# EAGLE design RaspberryPiSigfoxBoard (EAGLE 8.1.1)
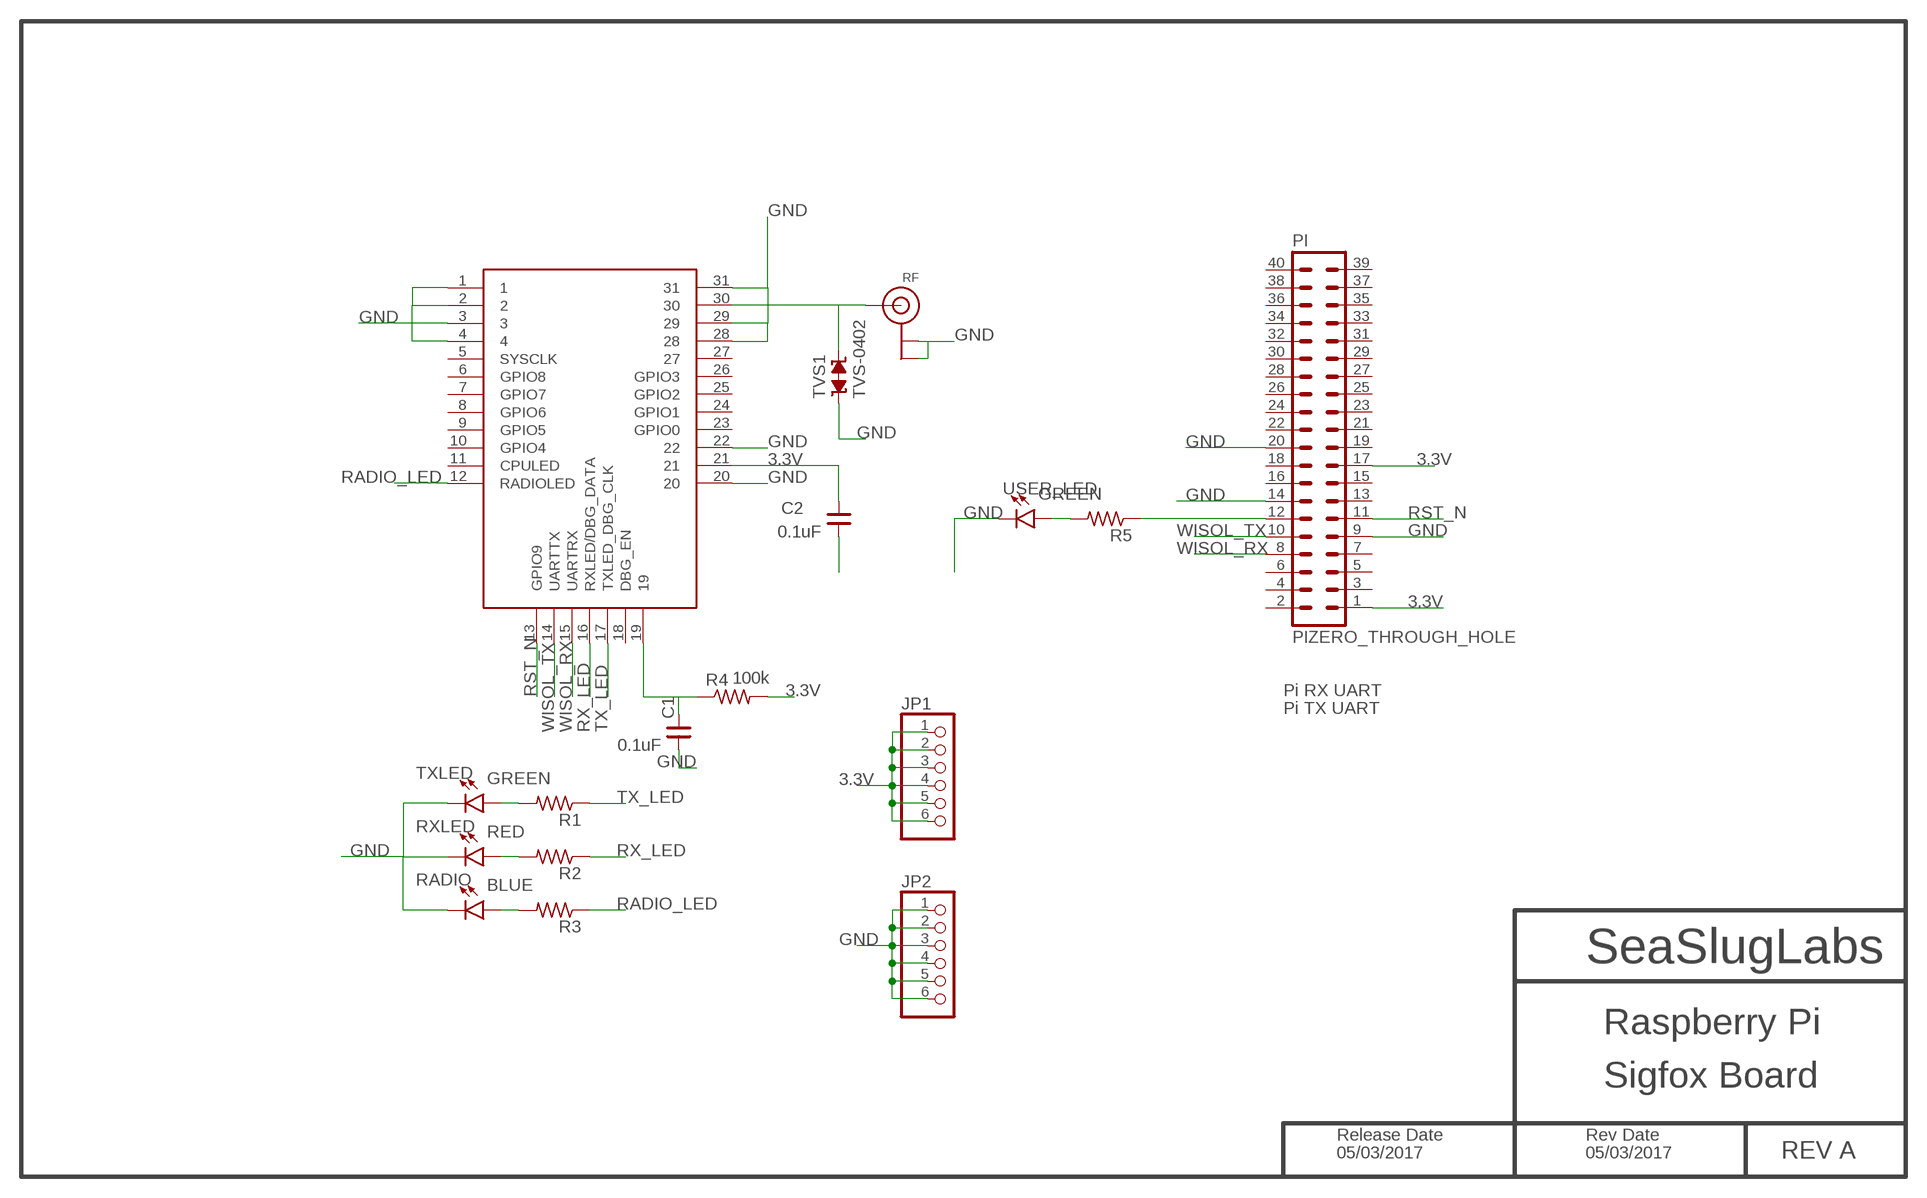
[diagram p0: schematic, sheet 1]

## Parts
C1  0.1uF  CNP-0402  [0402]
C2  0.1uF  CNP-0402  [0402]
JP1  PINHD-1X6B  [1X06-BIG]
JP2  PINHD-1X6B  [1X06-BIG]
PI  PIZERO_THROUGH_HOLE  [PIZERO_THOUGH_HOLE]
R1  R-US_R0402  [R0402]
R2  R-US_R0402  [R0402]
R3  R-US_R0402  [R0402]
R4  100k  R-US_R0402  [R0402]
R5  R-US_R0402  [R0402]
RADIO  BLUE  LED-BLUE0603  [LED-0603]
RF  ANTENNA_U.FL  [U.FL]
RXLED  RED  LED-RED0603  [LED-0603]
TVS1  TVS-0402  [TVS0402]
TXLED  GREEN  LED-GREEN0603  [LED-0603]
USER_LED  GREEN  LED-GREEN0603  [LED-0603]
WSSFM10R2  WSSFM10R2/R4WSSFM10R2R4  [WISOL]

## Nets
3.3V: C2.2 JP1.1 JP1.2 JP1.3 JP1.4 JP1.5 JP1.6 PI.1 PI.17 R4.2 WSSFM10R2.21
GND: C1.1 C2.1 JP2.1 JP2.2 JP2.3 JP2.4 JP2.5 JP2.6 PI.9 PI.14 PI.20 RADIO.C RF.1(GND) RF.2(GND) RXLED.C TVS1.1 TXLED.C USER_LED.C WSSFM10R2.1 WSSFM10R2.2 WSSFM10R2.3 WSSFM10R2.4 WSSFM10R2.20 WSSFM10R2.22 WSSFM10R2.28 WSSFM10R2.29 WSSFM10R2.31
N$1: C1.2 R4.1 WSSFM10R2.19
N$2: R1.2 TXLED.A
N$3: R2.2 RXLED.A
N$4: R3.2 RADIO.A
N$5: RF.3(SIGNAL) TVS1.2 WSSFM10R2.30
N$6: PI.12 R5.1
N$7: R5.2 USER_LED.A
RADIO_LED: R3.1 WSSFM10R2.12(RADIOLED)
RST_N: PI.11 WSSFM10R2.13(GPIO9)
RX_LED: R2.1 WSSFM10R2.16(RXLED/DBG_DATA)
TX_LED: R1.1 WSSFM10R2.17(TXLED_DBG_CLK)
WISOL_RX: PI.8 WSSFM10R2.15(UARTRX)
WISOL_TX: PI.10 WSSFM10R2.14(UARTTX)
Unconnected: PI.2 PI.3 PI.4 PI.5 PI.6 PI.7 PI.13 PI.15 PI.16 PI.18 PI.19 PI.21 PI.22 PI.23 PI.24 PI.25 PI.26 PI.27 PI.28 PI.29 PI.30 PI.31 PI.32 PI.33 PI.34 PI.35 PI.36 PI.37 PI.38 PI.39 PI.40 WSSFM10R2.5(SYSCLK) WSSFM10R2.6(GPIO8) WSSFM10R2.7(GPIO7) WSSFM10R2.8(GPIO6) WSSFM10R2.9(GPIO5) WSSFM10R2.10(GPIO4) WSSFM10R2.11(CPULED) WSSFM10R2.18(DBG_EN) WSSFM10R2.23(GPIO0) WSSFM10R2.24(GPIO1) WSSFM10R2.25(GPIO2) WSSFM10R2.26(GPIO3) WSSFM10R2.27

## Notes on the sheet
- Pi RX UART
- Pi TX UART
- SeaSlugLabs
- Raspberry Pi
- Sigfox Board
- Release Date | Rev Date
- 05/03/2017 | 05/03/2017 | REV A

## Library data of the parts
C1 C2 = IoTthings:CNP-: NON-POLARIZED CAP
JP1 JP2 = adafruit:PINHD-1X6: PIN HEADER
PI = pizero:PIZERO_THROUGH_HOLE
R1-R5 = IoTthings:R-US_: RESISTOR, American symbol
RADIO = IoTthings:LED-BLUE: Blue SMD LED Used in manufacturing of various products at SparkFun Packages: 0603 - SMD 0603 package [Product Link] <http://www.digikey.com/product-detail/en/SMLE12BC7TT86/511-1589-2-ND/1641808> 1206 - SMD1206 package [Product Link] <http://www.digikey.com/product-detail/en/lite-on-inc/LTST-C150TBKT/160-1643-1-ND/573584> SparkFun Products: ESP8266 Thing-Dev Board <https://www.sparkfun.com/products/13711> RedBoard <https://www.sparkfun.com/products/12757>; PROD_ID: DIO-08575
RF = IoTthings:ANTENNA_U.FL: U.FL Antenna Connector
RXLED = IoTthings:LED-RED: Red SMD LED Used in manufacturing of most products at SparkFun Packages: 0603 - SMD 0603 package [Product Link] <http://docs.avagotech.com/docs/AV02-0551EN> 0603 SMART - SMD 0603 SMART package ( more efficient and expensive)[Product Link] <http://www.osram-os.com/Graphics/XPic2/00077099_0.pdf> 1206 - SMD1206 package [Product Link] <https://www.sparkfun.com/datasheets/DevTools/LilyPad/Q150OVS4.pdff> SparkFun Products: Pro Mini 328 -5V <https://www.sparkfun.com/products/821> RedBoard <https://www.sparkfun.com/products/12757> IOIO-OTG <https://www.sparkfun.com/products/13613>; PROD_ID: DIO-00819
TVS1 = supressor:TVS-: TVS BI-DIRECTIONAL
TXLED USER_LED = IoTthings:LED-GREEN: Green SMD LED Used in manufacturing of various products at SparkFun Packages: 0603 - SMD 0603 package [Product Link] <http://www.futureelectronics.com/en/technologies/semiconductors/optoelectronics/leds/Pages/9894312-LTST-C190GKT.aspx?CrossPart=HSMG-C190&IM=0> LilyPad 1206 - SMD1206 LilyPad package [Product Link] <http://www.futureelectronics.com/en/Technologies/Product.aspx?ProductID=IN150NGHARVATEKCORPORATION2049943&IM=0> 1206 - SMD1206 package [Product Link] <http://www.futureelectronics.com/en/technologies/semiconductors/optoelectronics/leds/Pages/8315665-LTST-C150KGKT.aspx?IM=0> 1206 Bottom Mount -SMD 1206 Bottom Mount [Product Link] <http://www.digikey.com/product-detail/en/lite-on-inc/LTST-C230KGKT/160-1456-1-ND/386854> SparkFun Products: Pro Mini 328 -5V <https://www.sparkfun.com/products/821> RedBoard <https://www.sparkfun.com/products/12757> MP3 Trigger <https://www.sparkfun.com/products/13720> Makey Makey <https://www.sparkfun.com/products/11076>; PROD_ID: DIO-00821
WSSFM10R2 = SigfoxMod-RCZ1:WSSFM10R2/R4

## Board
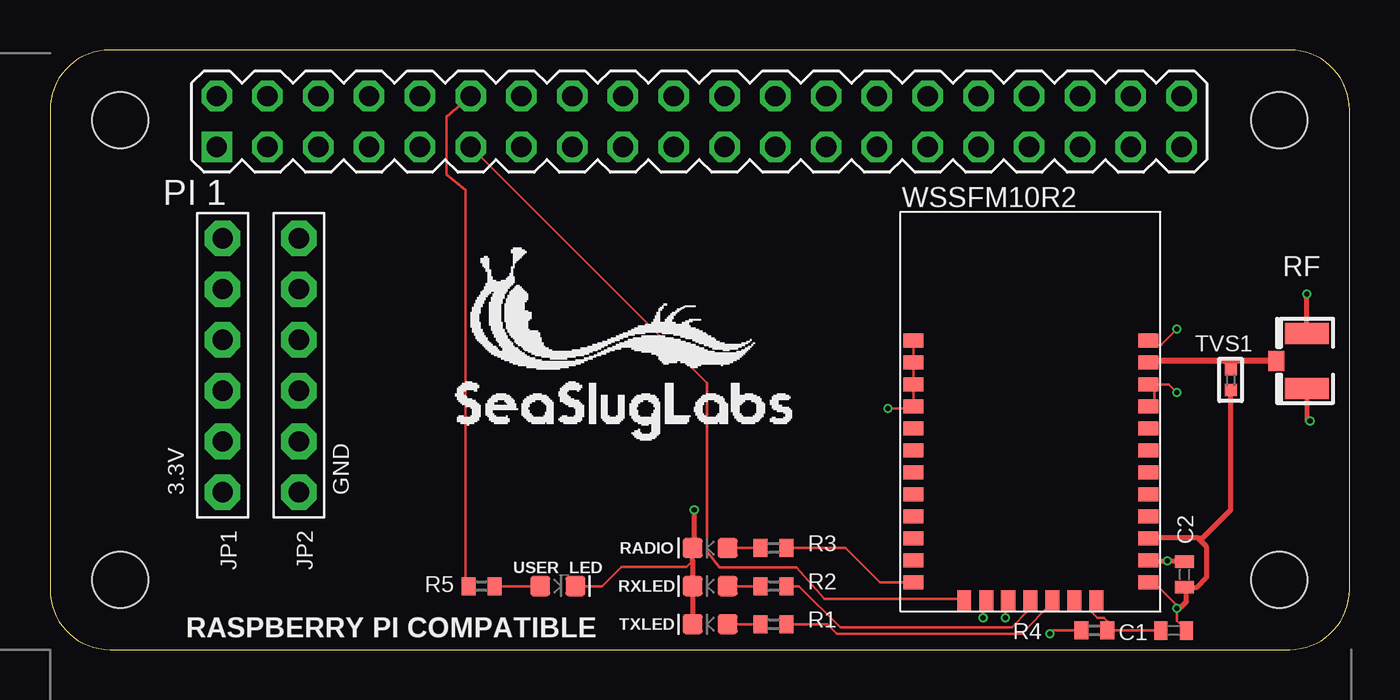
[diagram p1: board, top side]
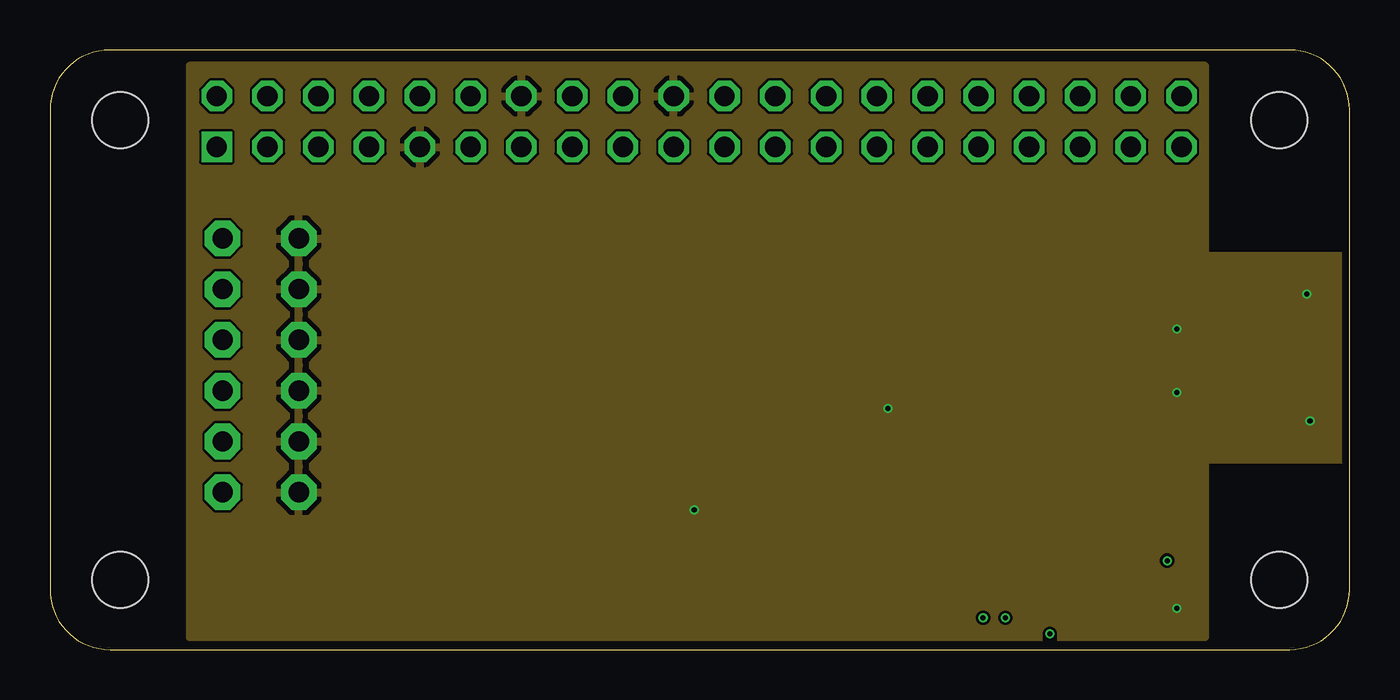
[diagram p2: board, inner layer Inner2]
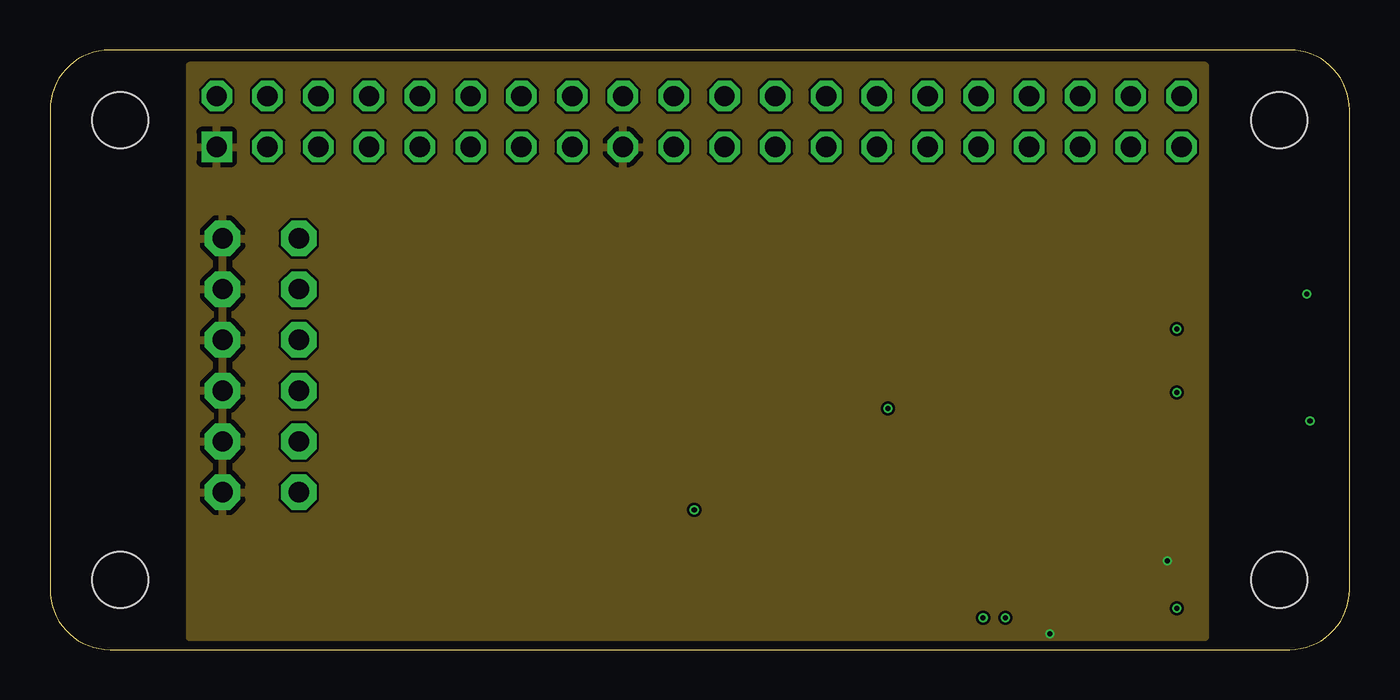
[diagram p3: board, inner layer inner3]
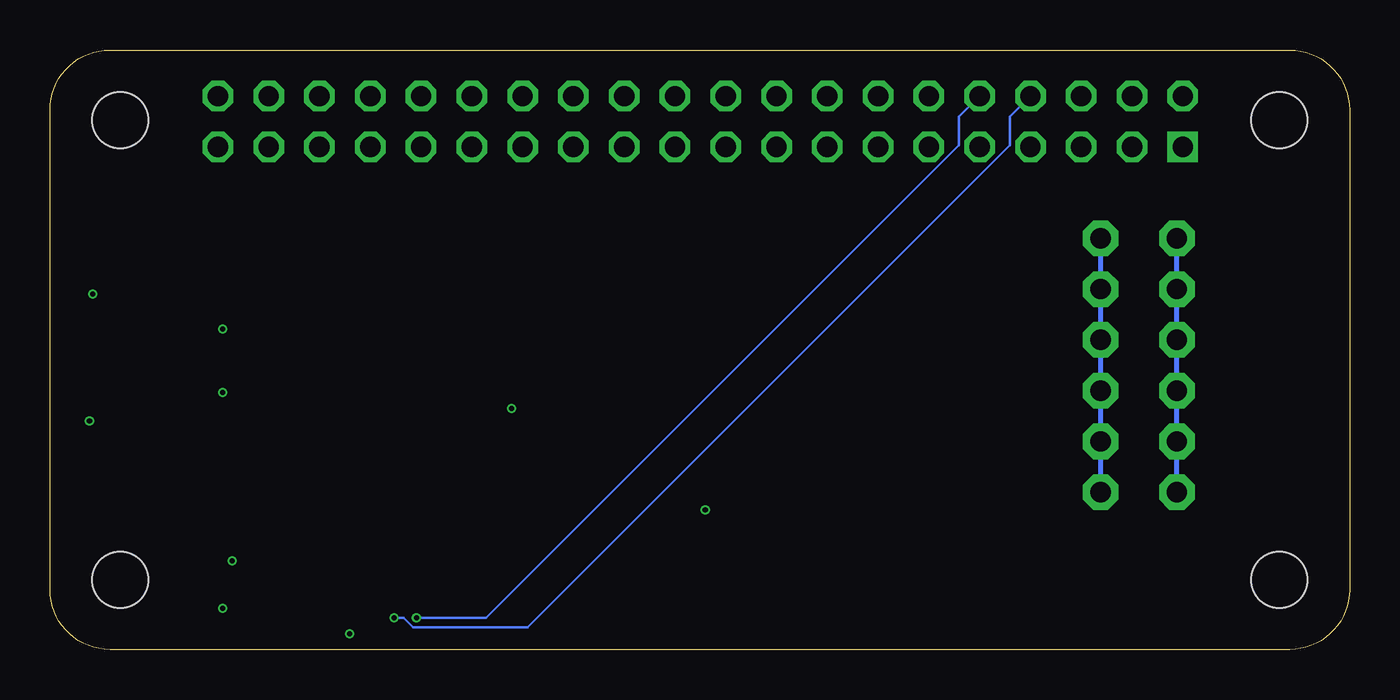
[diagram p4: board, bottom side, seen from below]

Size 65 x 30 mm. Coordinates in mm from the lower left corner, seen from the top.
Copper layers (1*2*15*16): Top 0.035mm / dielectric 0.175mm / Inner2 0.035mm / dielectric 1.13mm / inner3 0.035mm / dielectric 0.175mm / Bottom 0.035mm
Design rules "PCBway4layerStack": minimum track width 5mil, minimum drill 10mil, track to track 5mil, track to pad 5mil, pad to pad 5mil, via to via 5mil, smd to smd 5mil, copper to edge 15mil, drill to drill 6mil, minimum pad ring 4mil, minimum via ring 4mil, stop-mask expansion 2.5mil, vias tented up to drill 0mil, thermal gap 10mil
tRestrict: area 42.7,3.3 to 55.2,21.6

### Footprints (pad centres in the part's own frame; a part is rotated, then mirrored left to right if it is on the bottom)
0402 = smd 0.635 x 0.94: 1 -0.635,0; 2 0.635,0
1X06-BIG = drill 1.016 pad 1.778 octagon: 1 -6.35,0; 2 -3.81,0; 3 -1.27,0; 4 1.27,0; 5 3.81,0; 6 6.35,0
PIZERO_THOUGH_HOLE = drill 1.016 square: 1 8.34,25.15 | drill 1.016 octagon: 2 8.34,27.69; 3 10.88,25.15; 4 10.88,27.69; 5 13.42,25.15; 6 13.42,27.69; 7 15.96,25.15; 8 15.96,27.69; 9 18.5,25.15; 10 18.5,27.69; 11 21.04,25.15; 12 21.04,27.69; 13 23.58,25.15; 14 23.58,27.69; 15 26.12,25.15; 16 26.12,27.69; 17 28.66,25.15; 18 28.66,27.69; 19 31.2,25.15; 20 31.2,27.69; 21 33.74,25.15; 22 33.74,27.69; 23 36.28,25.15; 24 36.28,27.69; 25 38.82,25.15; 26 38.82,27.69; 27 41.36,25.15; 28 41.36,27.69; 29 43.9,25.15; 30 43.9,27.69; 31 46.44,25.15; 32 46.44,27.69; 33 48.98,25.15; 34 48.98,27.69; 35 51.52,25.15; 36 51.52,27.69; 37 54.06,25.15; 38 54.06,27.69; 39 56.6,25.15; 40 56.6,27.69 | hole 2.8: 3.5,3.5; 3.5,26.5; 61.5,26.5; 61.5,3.5
R0402 = smd 0.7 x 0.9: 1 -0.65,0; 2 0.65,0
LED-0603 = smd 1 x 1: A -0.877,0; C 0.877,0
U.FL = smd 2.2 x 1.05: 1 0,1.375; 2 0,-1.375 | smd 0.8 x 1: 3 1.525,0
TVS0402 = smd 0.6 x 0.6: 1 -0.508,0; 2 0.508,0
WISOL = smd 1 x 0.7: 1 0.65,13.55; 2 0.65,12.45; 3 0.65,11.35; 4 0.65,10.25; 5 0.65,9.15; 6 0.65,8.05; 7 0.65,6.95; 8 0.65,5.85; 9 0.65,4.75; 10 0.65,3.65; 11 0.65,2.55; 12 0.65,1.45; 20 12.4,1.45; 21 12.4,2.55; 22 12.4,3.65; 23 12.4,4.75; 24 12.4,5.85; 25 12.4,6.95; 26 12.4,8.05; 27 12.4,9.15; 28 12.4,10.25; 29 12.4,11.35; 30 12.4,12.45; 31 12.4,13.55 | smd 0.7 x 1: 13 3.18,0.56; 14 4.28,0.56; 15 5.38,0.56; 16 6.48,0.56; 17 7.58,0.56; 18 8.68,0.56; 19 9.78,0.56

### Placement (x,y rotation side)
C1  56.2,0.95 180 top
C2  56.74,3.76 90 top
JP1  8.64,14.22 90 top
JP2  12.45,14.22 90 top
PI  0,0 0 top
R1  36.2,1.27 180 top
R2  36.2,3.17 180 top
R3  36.2,5.08 180 top
R4  52.23,0.95 180 top
R5  21.59,3.17 0 top
RADIO  33.02,5.08 180 top
RF  62.87,14.45 180 top
RXLED  33.02,3.17 180 top
TVS1  59.05,13.49 90 top
TXLED  33.02,1.27 180 top
USER_LED  25.4,3.17 0 top
WSSFM10R2  42.55,1.91 0 top

### Tracks (layer width: path | path; a pad name or v marks a point on that pad's centre or on a via)
3.3V  (via drill 0.25)
  Top 0.127: 55.24,4.45 WSSFM10R2.21 | R4.2 50.16,0.95 v50.01,0.79
  Top 0.254: 55.24,4.45 v55.88,4.45 56.69,4.45 C2.2
  Bottom 0.254: JP1.1 JP1.2 JP1.3 JP1.4 JP1.5 JP1.6
  pour inner3: 57.79,0.63 57.79,29.21 6.98,29.21 6.98,0.63
GND  (via drill 0.25)
  Top 0.127: 55.24,3.17 WSSFM10R2.20 55.22,3.35 56.36,2.22 v56.36,2.06 56.36,1.43 C1.1 | WSSFM10R2.22 55.24,5.71 | WSSFM10R2.28 55.24,12.06 55.24,13.34 WSSFM10R2.29 55.96,13.26 v56.36,12.86 | 62.87,15.88 RF.2 | WSSFM10R2.31 55.24,15.24 55.56,15.24 v56.36,16.03 | 43.18,13.34 43.18,12.06 | 43.18,14.6 43.18,15.24 WSSFM10R2.1 | 43.18,14.6 43.18,13.34 | 43.18,13.34 WSSFM10R2.3 | 43.18,14.6 WSSFM10R2.2 | v41.91,12.06 43.18,12.06 | 43.18,12.06 WSSFM10R2.4 | 31.75,5.08 RADIO.C | 19.05,24.77 PI.9 | USER_LED.C 27.62,3.17 28.58,4.13 31.83,4.13 32.14,4.45 | 62.87,11.43 v63.02,11.43
  Top 0.254: TVS1.1 59.05,6.98 57.66,5.59 57.4,5.59 | RF.2 v62.87,17.78 | v32.23,6.98 32.23,5.08 RADIO.C 32.14,4.45 RXLED.C TXLED.C | RF.1 62.87,11.43 | v56.36,2.06 56.52,2.06 56.85,2.39 56.85,3.02 C2.1 57.38,3.12 57.86,3.61 57.86,5.13 57.4,5.59 | 57.4,5.59 54.98,5.59 WSSFM10R2.22
  Inner2 0.127: 62.87,11.43 v63.02,11.43
  Bottom 0.254: JP2.1 JP2.2 JP2.3 JP2.4 JP2.5 JP2.6
  pour Inner2: 6.98,29.21 6.98,0.63 57.79,0.63 57.79,9.52 64.77,9.52 64.77,19.69 57.79,19.69 57.79,29.21
N$1
  Top 0.127: WSSFM10R2.19 52.07,2.54 52.07,1.91 52.39,1.59 52.71,1.59 52.88,1.41 R4.1 C1.2
N$2
  Top 0.127: TXLED.A R1.2
N$3
  Top 0.127: RXLED.A R2.2
N$4
  Top 0.127: RADIO.A R3.2
N$5
  Top 0.127: 59.05,14.45 TVS1.2 59.05,13.97
  Top 0.305: RF.3 59.05,14.45 54.95,14.45
  Top 0.406: 54.95,14.45 WSSFM10R2.30
N$6
  Top 0.127: R5.1 20.8,3.17 20.8,22.98 19.84,23.77 19.84,26.67 20.95,27.62 PI.12
N$7
  Top 0.127: USER_LED.A R5.2
RADIO_LED
  Top 0.127: R3.1 36.86,5.09 39.78,5.09 41.51,3.35 WSSFM10R2.12 43.18,3.17
RST_N
  Top 0.127: WSSFM10R2.13 45.72,2.54 38.74,2.54 37.33,4.12 33.5,4.12 32.86,4.92 32.86,13.34 21.11,25.08 PI.11
RX_LED
  Top 0.127: R2.1 37.46,3.17 39.53,1.11 48.1,1.11 48.9,1.91 48.9,2.54 WSSFM10R2.16
TX_LED
  Top 0.127: R1.1 38.89,1.27 39.37,0.79 48.58,0.79 50.16,2.38 WSSFM10R2.17 50.16,2.54
WISOL_RX  (via drill 0.25)
  Top 0.127: v47.78,1.59 47.78,2.38 WSSFM10R2.15
  Bottom 0.127: v47.78,1.59 47.31,1.59 46.83,1.11 41.12,1.11 16.99,25.24 16.99,26.67 16.03,27.62 PI.8
WISOL_TX  (via drill 0.25)
  Top 0.127: v46.67,1.59 46.67,2.38 WSSFM10R2.14
  Bottom 0.127: v46.67,1.59 43.18,1.59 19.53,25.24 19.53,26.67 18.57,27.62 PI.10

### Text on the board
tPlace: 3.3V | GND | RASPBERRY PI COMPATIBLE